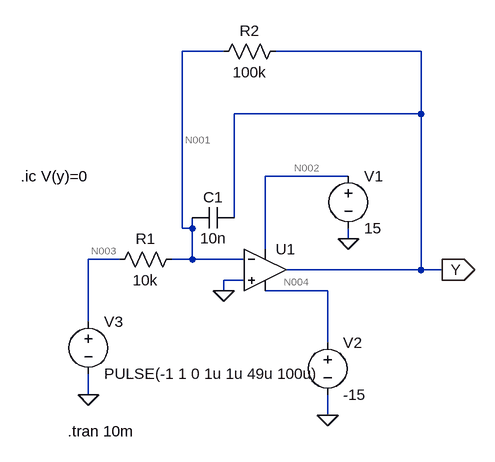
[diagram p0: schematic integrator.asc]
integrator.asc, the LTspice schematic file:
Version 4.1
SHEET 1 880 680
WIRE 128 -192 64 -192
WIRE 432 -192 208 -192
WIRE 432 -96 432 -192
WIRE 432 -96 144 -96
WIRE 320 0 192 0
WIRE 144 64 144 -96
WIRE 64 80 64 -192
WIRE 80 80 80 64
WIRE 80 80 64 80
WIRE 320 96 320 80
WIRE 192 112 192 0
WIRE -32 128 -80 128
WIRE 80 128 80 80
WIRE 80 128 48 128
WIRE 160 128 80 128
WIRE 432 144 432 -96
WIRE 432 144 224 144
WIRE 464 144 432 144
WIRE 160 160 128 160
WIRE 128 176 128 160
WIRE 288 176 192 176
WIRE -80 224 -80 128
WIRE 288 256 288 176
WIRE -80 336 -80 304
WIRE 288 368 288 336
FLAG -80 336 0
FLAG 320 96 0
FLAG 288 368 0
FLAG 128 176 0
FLAG 464 144 Y
IOPIN 464 144 Out
SYMBOL OpAmps\\UniversalOpAmp2 192 144 R0
SYMATTR InstName U1
SYMBOL voltage 320 -16 R0
WINDOW 123 0 0 Left 0
WINDOW 39 0 0 Left 0
SYMATTR InstName V1
SYMATTR Value 15
SYMBOL voltage 288 240 R0
WINDOW 123 0 0 Left 0
WINDOW 39 0 0 Left 0
SYMATTR InstName V2
SYMATTR Value -15
SYMBOL voltage -80 208 R0
WINDOW 123 0 0 Left 0
WINDOW 39 0 0 Left 0
SYMATTR InstName V3
SYMATTR Value PULSE(-1 1 0 1u 1u 49u 100u)
SYMBOL res 64 112 R90
WINDOW 0 0 56 VBottom 2
WINDOW 3 32 56 VTop 2
SYMATTR InstName R1
SYMATTR Value 10k
SYMBOL cap 144 48 R90
WINDOW 0 0 32 VBottom 2
WINDOW 3 32 32 VTop 2
SYMATTR InstName C1
SYMATTR Value 10n
SYMBOL res 224 -208 R90
WINDOW 0 0 56 VBottom 2
WINDOW 3 32 56 VTop 2
SYMATTR InstName R2
SYMATTR Value 100k
TEXT -112 392 Left 2 !.tran 10m
TEXT -184 0 Left 2 !.ic V(y)=0

The netlist it stands for:
* integrator.asc
X§U1 0 N001 N002 N004 Y level2 Avol=1Meg GBW=10Meg Slew=10Meg Ilimit=25m Rail=0 Vos=0 En=0 Enk=0 In=0 Ink=0 Rin=500Meg  ; pins In+ In- V+ V- OUT
V1 N002 0 15
V2 N004 0 -15
V3 N003 0 PULSE(-1 1 0 1u 1u 49u 100u)
R1 N001 N003 10k
C1 Y N001 10n
R2 Y N001 100k
.tran 10m
.ic V(y)=0
.lib UniversalOpAmp2.lib
.backanno
.end

* Results of the author's LTspice run, read from the files saved beside the schematic
* Operating Point, zero values left out:
*   V(n001) = -909.1 mV
*   V(n002) = 15 V
*   V(n003) = -1 V
*   V(n004) = -15 V
*   I(R1) = 9.093 µA
*   I(R2) = 9.091 µA
*   I(V1) = -25 mA
*   I(V2) = 1.766 µA
*   I(V3) = 9.093 µA
*   Ix(u1:2) = -1.818 nA
*   Ix(u1:3) = 25 mA
*   Ix(u1:4) = -1.766 µA
*   Ix(u1:5) = -25 mA
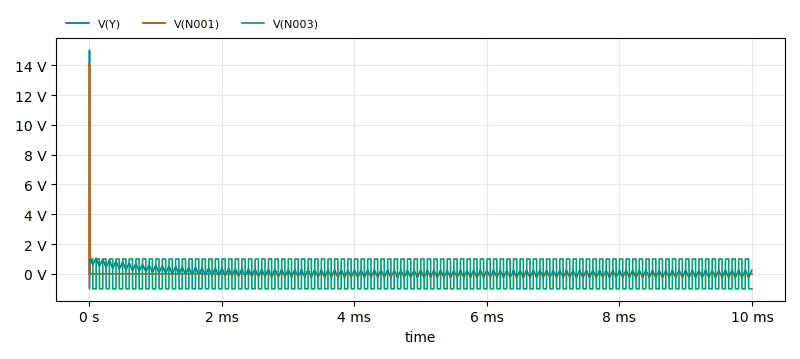
[diagram p1: Transient Analysis of integrator.asc, plotted from the saved traces]
* Transient Analysis, 1 run:
*   V(Y): min -245 mV, max 15 V, average 91.97 mV, rms 308.3 mV, last 245 mV
*   V(N001): min -909.1 mV, max 14.09 V, average 2.331 mV, rms 168 mV, last -55.41 µV
*   V(N003): min -1 V, max 1 V, average 683.9 nV, rms 1 V, last -1 V